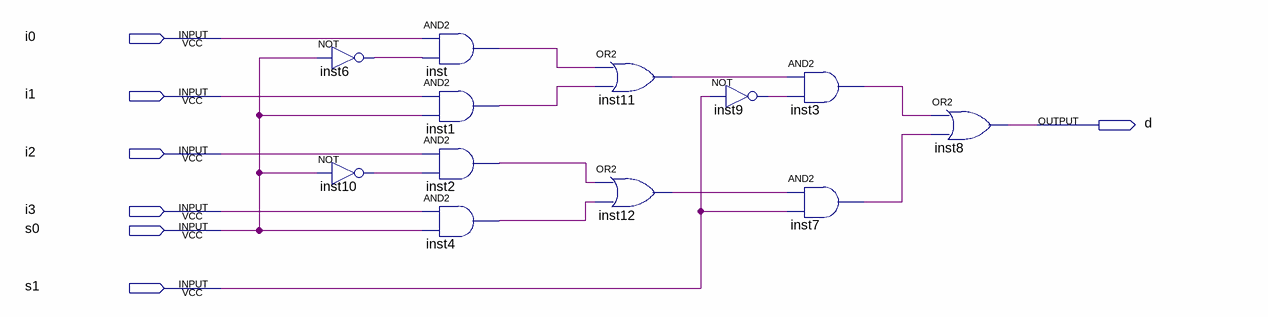
[diagram p0: schematic sheet]
// Quartus schematic Q1.bdf as structural Verilog: 12 symbols, 7 pins
module Q1 (
  input  i0,
  input  i1,
  input  i2,
  input  i3,
  input  s0,
  input  s1,
  output d
);

  wire inst1_out, inst2_out, inst3_out, inst4_out, inst6_out, inst7_out, inst9_out, inst10_out, inst11_out,
       inst12_out, inst_out;

  not inst6 (inst6_out, s0);
  not inst10 (inst10_out, s0);
  and inst (inst_out, i0, inst6_out);
  and inst1 (inst1_out, i1, s0);
  and inst2 (inst2_out, i2, inst10_out);
  and inst4 (inst4_out, i3, s0);
  or inst11 (inst11_out, inst_out, inst1_out);
  or inst12 (inst12_out, inst2_out, inst4_out);
  not inst9 (inst9_out, s1);
  and inst3 (inst3_out, inst11_out, inst9_out);
  and inst7 (inst7_out, inst12_out, s1);
  or inst8 (d, inst3_out, inst7_out);
endmodule
